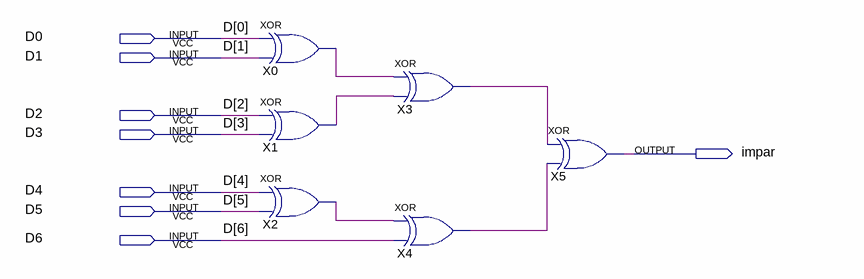
[diagram p0: schematic sheet]
// Quartus schematic XOR7.bdf as structural Verilog: 6 symbols, 8 pins
module XOR7 (
  input  D0,
  input  D1,
  input  D2,
  input  D3,
  input  D4,
  input  D5,
  input  D6,
  output impar
);

  wire X0_out, X1_out, X2_out, X3_out, X4_out;

  xor X0 (X0_out, D0, D1);
  xor X1 (X1_out, D2, D3);
  xor X2 (X2_out, D4, D5);
  xor X3 (X3_out, X0_out, X1_out);
  xor X4 (X4_out, X2_out, D6);
  xor X5 (impar, X3_out, X4_out);
endmodule
